# EAGLE design LAN-Bee_v12 (EAGLE 7.7.0)
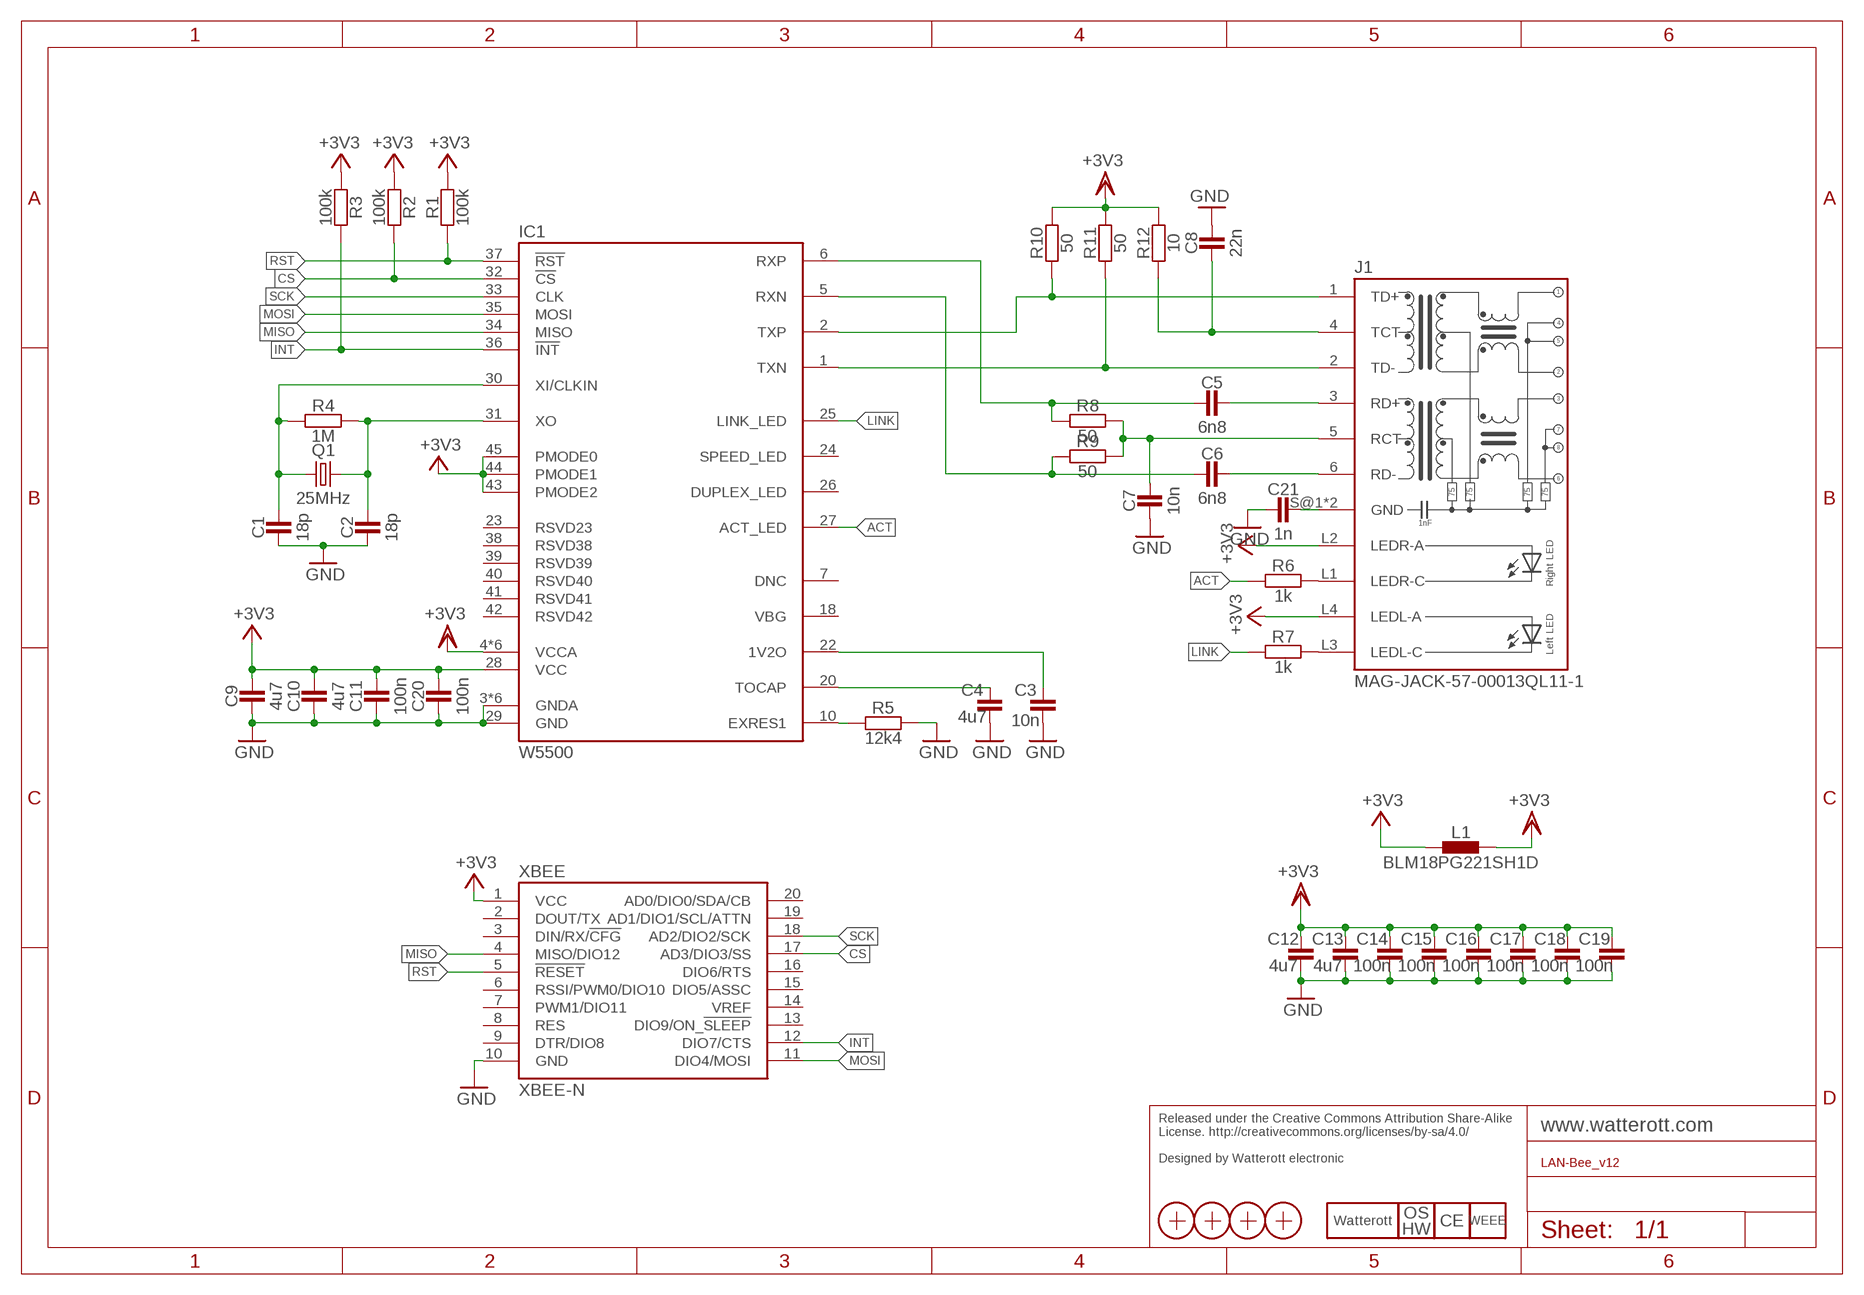
[diagram p0: schematic, sheet 1]

## Parts
C1  18p  CAPACITOR-0402  [C0402]
C2  18p  CAPACITOR-0402  [C0402]
C3  10n  CAPACITOR-0402  [C0402]
C4  4u7  CAPACITOR-0603  [C0603]
C5  6n8  CAPACITOR-0402  [C0402]
C6  6n8  CAPACITOR-0402  [C0402]
C7  10n  CAPACITOR-0402  [C0402]
C8  22n  CAPACITOR-0402  [C0402]
C9  4u7  CAPACITOR-0603  [C0603]
C10  4u7  CAPACITOR-0603  [C0603]
C11  100n  CAPACITOR-0402  [C0402]
C12  4u7  CAPACITOR-0603  [C0603]
C13  4u7  CAPACITOR-0603  [C0603]
C14  100n  CAPACITOR-0402  [C0402]
C15  100n  CAPACITOR-0402  [C0402]
C16  100n  CAPACITOR-0402  [C0402]
C17  100n  CAPACITOR-0402  [C0402]
C18  100n  CAPACITOR-0402  [C0402]
C19  100n  CAPACITOR-0402  [C0402]
C20  100n  CAPACITOR-0402  [C0402]
C21  1n  CAPACITOR-0805  [C0805]
IC1  W5500  [TQFP48]
J1  MAG-JACK-57-00013QL11-1  [RJ45_57-00013QL11-1]
L1  BLM18PG221SH1D  INDUCTOR-0603  [C0603]
LOGO1  LOGO_WEEE-4  [WEEE_4MM]
LOGO2  LOGO_CE-2  [CE_2MM]
LOGO3  LOGO_OSHW-2  [OSHW_2MM]
LOGO5  LOGO_SPARK-2  [SPARK_2MM]
Q1  25MHz  CRYSTAL-CC2  [CRYSTAL_CC2]
R1  100k  RESISTOR-0402  [C0402]
R2  100k  RESISTOR-0402  [C0402]
R3  100k  RESISTOR-0402  [C0402]
R4  1M  RESISTOR-0402  [C0402]
R5  12k4  RESISTOR-0402  [C0402]
R6  1k  RESISTOR-0402  [C0402]
R7  1k  RESISTOR-0402  [C0402]
R8  50  RESISTOR-0402  [C0402]
R9  50  RESISTOR-0402  [C0402]
R10  50  RESISTOR-0402  [C0402]
R11  50  RESISTOR-0402  [C0402]
R12  10  RESISTOR-0402  [C0402]
X1  PASSER-07  [PASSER_07MM]
X2  PASSER-07  [PASSER_07MM]
X3  PASSER-07  [PASSER_07MM]
X4  PASSER-07  [PASSER_07MM]
XBEE  XBEE-N  [XBEE_N]

## Nets
+3V3: C9.2 C10.2 C11.2 C20.2 IC1.28(VCC) IC1.43(PMODE2) IC1.44(PMODE1) IC1.45(PMODE0) J1.L2(LEDR-A) J1.L4(LEDL-A) L1.1 R1.2 R2.2 R3.2 XBEE.1(VCC)
ACT: IC1.27(ACT_LED) R6.2
CS: IC1.32(!CS) R2.1 XBEE.17(AD3/DIO3/SS)
GND: C1.1 C2.1 C3.1 C4.1 C7.1 C8.2 C9.1 C10.1 C11.1 C12.1 C13.1 C14.1 C15.1 C16.1 C17.1 C18.1 C19.1 C20.1 C21.1 IC1.3(GNDA) IC1.9(GNDA) IC1.14(GNDA) IC1.16(GNDA) IC1.19(GNDA) IC1.29(GND) IC1.48(GNDA) R5.2 XBEE.10(GND)
INT: IC1.36(!INT) R3.1 XBEE.12(DIO7/CTS)
LEDLC: J1.L3(LEDL-C) R7.1
LEDRC: J1.L1(LEDR-C) R6.1
LINK: IC1.25(LINK_LED) R7.2
MISO: IC1.34(MISO) XBEE.4(MISO/DIO12)
MOSI: IC1.35(MOSI) XBEE.11(DIO4/MOSI)
N$5: IC1.10(EXRES1) R5.1
N$6: C3.2 IC1.22(1V2O)
N$7: C4.2 IC1.20(TOCAP)
N$8: C2.2 IC1.31(XO) Q1.2 R4.2
N$9: C1.2 IC1.30(XI/CLKIN) Q1.1 R4.1
RCT: C7.2 J1.5(RCT) R8.1 R9.1
RD+: C5.2 J1.3(RD+)
RD-: C6.2 J1.6(RD-)
RST: IC1.37(!RST) R1.1 XBEE.5(!RESET!)
RXN: C6.1 IC1.5(RXN) R9.2
RXP: C5.1 IC1.6(RXP) R8.2
SCK: IC1.33(CLK) XBEE.18(AD2/DIO2/SCK)
SHLD: C21.2 J1.S@1(GND) J1.S@2(GND)
TCT: C8.1 J1.4(TCT) R12.2
TD+: IC1.2(TXP) J1.1(TD+) R10.2
TD-: IC1.1(TXN) J1.2(TD-) R11.2
VDD: C12.2 C13.2 C14.2 C15.2 C16.2 C17.2 C18.2 C19.2 IC1.4(VCCA) IC1.8(VCCA) IC1.11(VCCA) IC1.15(VCCA) IC1.17(VCCA) IC1.21(VCCA) L1.2 R10.1 R11.1 R12.1 ; supply symbol labelled +3V3
Unconnected: IC1.7(DNC) IC1.18(VBG) IC1.23(RSVD23) IC1.24(SPEED_LED) IC1.26(DUPLEX_LED) IC1.38(RSVD38) IC1.39(RSVD39) IC1.40(RSVD40) IC1.41(RSVD41) IC1.42(RSVD42) XBEE.2(DOUT/TX) XBEE.3(DIN/RX/!CFG!) XBEE.6(RSSI/PWM0/DIO10) XBEE.7(PWM1/DIO11) XBEE.8(RES) XBEE.9(DTR/DIO8) XBEE.13(DIO9/ON_!SLEEP!) XBEE.14(VREF) XBEE.15(DIO5/ASSC) XBEE.16(DIO6/RTS) XBEE.19(AD1/DIO1/SCL/ATTN) XBEE.20(AD0/DIO0/SDA/CB)

## Notes on the sheet
- Released under the Creative Commons Attribution Share-Alike 
  License. http://creativecommons.org/licenses/by-sa/4.0/
  
  Designed by Watterott electronic

## Library data of the parts
C1-C21 = we-rcl:CAPACITOR: Capacitors ...2.2uF @ 6.3V -> 0402 ...4.7uF @ 6.3V -> 0603 ...10uF @ 16V -> 0805 ...22uF @ 25V -> 1206
IC1 = we-chip:W5500: WIZnet W5500 Ethernet Controller (5V tolerante IOs)
J1 = we-con:MAG-JACK: RJ45 connector with integrated magnetics (MagJack) Wuerth 7499011222A (THT) UDE 57-00013QL11-1 (THT, Low Profile) Taimag RJSL-002TC1 (SMD, Low Profile)
L1 = we-rcl:INDUCTOR: Inductors Ferrite Bead - Murata BLM18PG 0603 3.0A 33Ohm @ 100MH -> BLM18PG330SN1D 0603 2.0A 120Ohm @ 100MH -> BLM18PG121SN1D 0603 1.4A 220Ohm @ 100MH -> BLM18PG221SH1D 0603 1.2A 330Ohm @ 100MH -> BLM18PG331SN1D 0603 1.0A 470Ohm @ 100MH -> BLM18PG471SN1D
LOGO1 = we-symbol:LOGO_WEEE: WEEE Logo
LOGO2 = we-symbol:LOGO_CE: CE Logo
LOGO3 = we-symbol:LOGO_OSHW: Open-Source-Hardware Logo
LOGO5 = we-symbol:LOGO_SPARK: Watterott electronic Logo
Q1 = we-rcl:CRYSTAL: Crystals
R1-R12 = we-rcl:RESISTOR: Resistors all kinds in 0402 and 0603
X1-X4 = we-symbol:PASSER: Fiducial Markers
XBEE = we-board:XBEE: XBEE connector

## Board
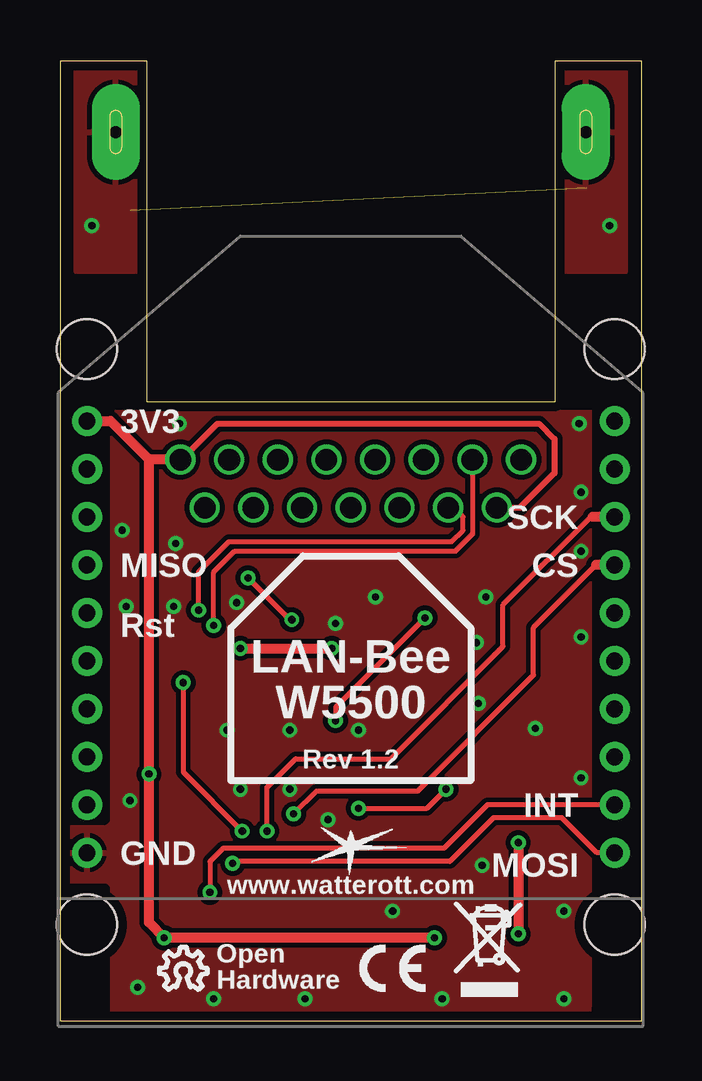
[diagram p1: board, top side]
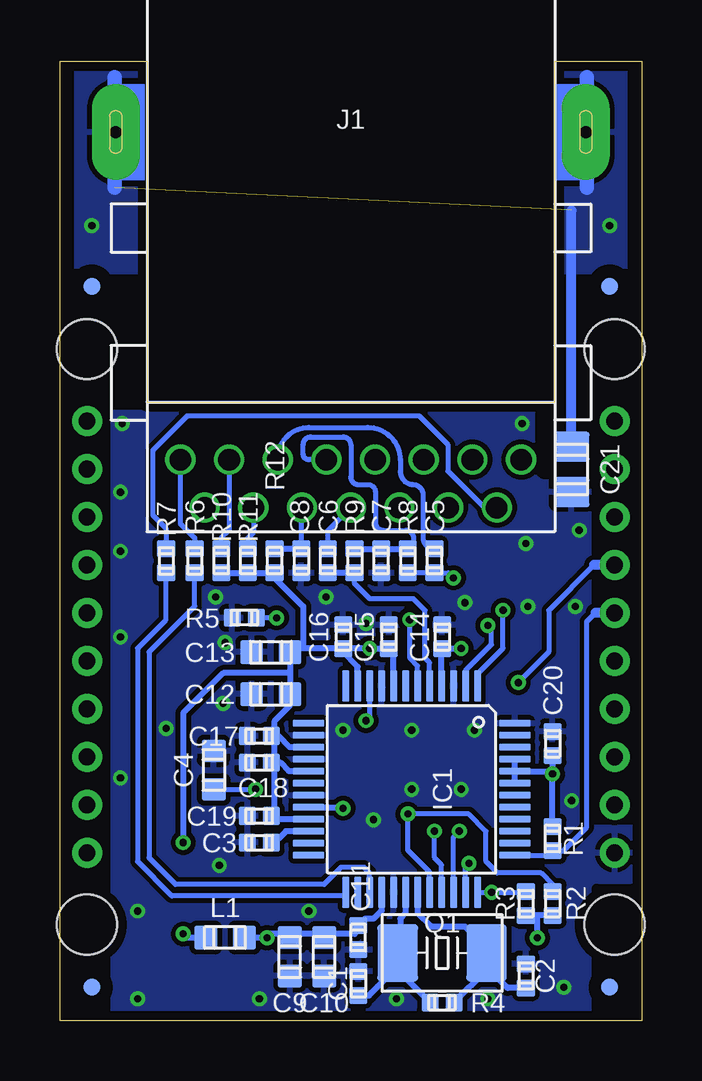
[diagram p2: board, bottom side, seen from below]

Size 24.25 x 40 mm. Coordinates in mm from the lower left corner, seen from the top.
Outline: 24.25,0 24.25,40 20.62,40 20.62,25.8 3.62,25.8 3.62,40 0,40 0,0 24.25,0
Copper layers (1*16): Top 0.035mm / dielectric 1.5mm / Bottom 0.035mm
Design rules "we-dru-2-layer *": minimum track width 0.15mm, minimum drill 0.3mm, track to track 0.15mm, track to pad 0.15mm, pad to pad 0.15mm, via to via 0.15mm, smd to smd 0.1mm, copper to edge 0.4mm, drill to drill 0.2mm, minimum pad ring 0.18mm, minimum via ring 0.16mm, stop-mask expansion 0.1mm, vias tented up to drill 0.5mm, thermal gap 0.2mm
Holes 2.5 mm at 1.12,4 23.12,4 1.12,28 23.12,28
tRestrict: area 0.4,8.4 to 1.9,29; area 22.4,0.5 to 23.9,29; area 0.4,0.5 to 1.9,5.5
bRestrict: area 0.4,8.4 to 1.9,29; area 22.4,0.5 to 23.9,29; area 0.4,0.5 to 1.9,5.5; 2 lines

### Footprints (pad centres in the part's own frame; a part is rotated, then mirrored left to right if it is on the bottom)
C0402 = smd 0.75 x 0.7: 1 0,0.5; 2 0,-0.5
C0603 = smd 1 x 0.95: 1 0,0.8; 2 0,-0.8
C0805 = smd 1.5 x 1.25: 1 0,0.95; 2 0,-0.95
TQFP48 = smd 1.3 x 0.28: 1 -4.3,2.75; 2 -4.3,2.25; 3 -4.3,1.75; 4 -4.3,1.25; 5 -4.3,0.75; 6 -4.3,0.25; 7 -4.3,-0.25; 8 -4.3,-0.75; 9 -4.3,-1.25; 10 -4.3,-1.75; 11 -4.3,-2.25; 12 -4.3,-2.75; 25 4.3,-2.75; 26 4.3,-2.25; 27 4.3,-1.75; 28 4.3,-1.25; 29 4.3,-0.75; 30 4.3,-0.25; 31 4.3,0.25; 32 4.3,0.75; 33 4.3,1.25; 34 4.3,1.75; 35 4.3,2.25; 36 4.3,2.75 | smd 0.28 x 1.3: 13 -2.75,-4.3; 14 -2.25,-4.3; 15 -1.75,-4.3; 16 -1.25,-4.3; 17 -0.75,-4.3; 18 -0.25,-4.3; 19 0.25,-4.3; 20 0.75,-4.3; 21 1.25,-4.3; 22 1.75,-4.3; 23 2.25,-4.3; 24 2.75,-4.3; 37 2.75,4.3; 38 2.25,4.3; 39 1.75,4.3; 40 1.25,4.3; 41 0.75,4.3; 42 0.25,4.3; 43 -0.25,4.3; 44 -0.75,4.3; 45 -1.25,4.3; 46 -1.75,4.3; 47 -2.25,4.3; 48 -2.75,4.3
RJ45_57-00013QL11-1 = drill 0.9: 1 -5.075,-11.66; 2 -4.06,-13.66; 3 -3.045,-11.66; 4 -2.03,-13.66; 5 -1.015,-11.66; 6 0,-13.66; 7 1.015,-11.66; 8 2.03,-13.66; 9 3.045,-11.66; 10 4.06,-13.66; 11 5.075,-11.66; L1 -7.105,-11.66; L2 -6.09,-13.66; L3 6.09,-13.66; L4 7.105,-11.66 | drill 0.5 pad 2 long: S@1 -9.8,2; S@2 9.8,2
CRYSTAL_CC2 = smd 2.4 x 1.7: 1 0,1.85; 2 0,-1.85
PASSER_07MM = smd 0.7 x 0.7: X 0,0
XBEE_N = drill 0.7 pad 1.25: 1 -11,9; 2 -11,7; 3 -11,5; 4 -11,3; 5 -11,1; 6 -11,-1; 7 -11,-3; 8 -11,-5; 9 -11,-7; 10 -11,-9; 11 11,-9; 12 11,-7; 13 11,-5; 14 11,-3; 15 11,-1; 16 11,1; 17 11,3; 18 11,5; 19 11,7; 20 11,9

### Placement (x,y rotation side)
C1  11.81,1.55 0 bottom
C2  4.82,1.87 0 bottom
C3  15.94,7.43 90 bottom
C4  17.84,10.44 0 bottom
C5  8.63,19.18 180 bottom
C6  13.08,19.18 180 bottom
C7  10.86,19.18 180 bottom
C8  14.19,19.18 0 bottom
C9  14.66,2.66 180 bottom
C10  13.24,2.66 180 bottom
C11  11.81,3.46 180 bottom
C12  15.46,13.62 90 bottom
C13  15.46,15.37 90 bottom
C14  8.31,16 0 bottom
C15  10.54,16 0 bottom
C16  12.44,16 0 bottom
C17  15.94,11.87 90 bottom
C18  15.94,10.76 90 bottom
C19  15.94,8.54 90 bottom
C20  3.71,11.55 0 bottom
C21  2.92,22.98 180 bottom
IC1  9.59,9.65 270 bottom
J1  12.12,35.05 0 bottom
L1  17.36,3.46 270 bottom
LOGO1  17.84,2.98 0 top
LOGO2  13.87,2.19 0 top
LOGO3  5.14,2.19 0 top
LOGO5  12.12,7.27 0 top
Q1  8.31,2.82 90 bottom
R1  3.71,7.59 180 bottom
R2  3.71,4.89 0 bottom
R3  4.82,4.89 0 bottom
R4  8.31,0.76 90 bottom
R5  16.57,16.79 270 bottom
R6  18.63,19.18 0 bottom
R7  19.82,19.18 0 bottom
R8  9.74,19.18 0 bottom
R9  11.97,19.18 0 bottom
R10  17.52,19.18 180 bottom
R11  16.41,19.18 180 bottom
R12  15.3,19.18 180 bottom
X1  1.33,1.39 0 bottom
X2  1.33,30.61 0 bottom
X3  22.92,30.61 0 bottom
X4  22.92,1.39 0 bottom
XBEE  12.12,16 0 top

### Tracks (layer width: path | path; a pad name or v marks a point on that pad's centre or on a via)
+3V3  (via drill 0.3)
  Top 0.203: 3.72,23.39 3.71,23.38
  Top 0.254: J1.L2 19.18,21.39 20.62,22.83 20.62,24.26 19.98,24.89 6.57,24.89 5.07,23.39 J1.L4
  Top 0.406: v15.62,3.46 v4.35,3.46 3.71,4.09 v3.71,10.29 3.71,23.38 | J1.L4 3.72,23.39 2.11,25 XBEE.1
  Bottom 0.203: C9.2 14.66,3.62 | C10.2 13.24,3.62
  Bottom 0.254: IC1.43 IC1.44 | IC1.44 IC1.45 | R1.2 v3.71,10.29 | L1.1 v15.62,3.46 15.46,3.62 14.66,3.62 13.24,3.62 11.97,3.62 11.81,3.78 C11.2 | R2.2 4.35,4.39 | 4.35,4.39 R3.2 | C20.2 v3.71,10.29 | IC1.44 3.83,10.4 v3.71,10.29 | v4.35,3.46 4.35,4.39 | IC1.28 10.84,4.59 11.17,4.25 11.51,4.25 C11.2 | 11.81,3.94 C11.2
ACT
  Bottom 0.203: IC1.27 11.34,6.16 11.57,6.4 12.52,6.4 13.24,5.68 19.43,5.68 20.54,6.79 20.54,15.37 18.63,17.27 R6.2
CS  (via drill 0.3)
  Top 0.203: v9.74,8.62 10.7,9.57 14.9,9.57 19.75,14.41 19.75,16.4 22.35,19
  Top 0.406: XBEE.17 22.35,19
  Bottom 0.203: R2.1 3.71,5.68 4.19,6.16 6.01,6.16 6.49,6.63 6.49,7.9 7.2,8.62 v9.74,8.62 9.74,7.11 8.84,6.2 IC1.32
GND  (via drill 0.3)
  other vias: 7.36,17.43 11.49,16.56 21.65,24.89 9.59,12.11 6.97,12.11 12.44,12.11 3.23,1.39 17.36,15.76 21.73,19.57 21.73,16 9.59,9.65 17.44,13.22 21.73,10.13 19.82,12.19 15.94,0.92 11.17,8.38 2.6,20.45 4.74,17.27 21.73,22.03 2.76,17.27 21.02,4.57 6.41,0.92 21.02,0.92 17.6,6.47 7.52,9.65 4.82,19.89 13.16,17.67 4.98,24.89 10.22,0.92 13.87,4.57 2.92,9.17 17.76,17.67
  pour Top (isolate 0.203): 24.25,0 0,0 0,25.39 24.25,25.39
  pour Bottom (isolate 0.203): 0,0 24.25,0 24.25,25.39 0,25.39
INT  (via drill 0.3)
  Top 0.203: XBEE.12 17.82,9 16.01,7.19 6.81,7.19 6.25,6.63 v6.25,5.35
  Bottom 0.203: IC1.36 v6.25,5.35 4.86,5.35 R3.1
LEDLC
  Bottom 0.203: R7.1 19.82,20.52 20.38,21.08 20.38,23.78 18.95,25.21 9.27,25.21 8.08,24.02 8.08,22.91 6.56,21.39 J1.L3
LEDRC
  Bottom 0.203: J1.L1 19.23,20.72 18.63,20.13 R6.1
LINK
  Bottom 0.203: IC1.25 12.34,5.23 12.36,5.21 19.59,5.21 21.02,6.63 21.02,15.52 19.82,16.71 R7.2
MISO  (via drill 0.3)
  Top 0.203: v5.14,14.1 5.14,10.36 v7.6,7.9
  Bottom 0.203: 1.98,19 3.87,17.11 3.87,15.37 v5.14,14.1 | IC1.34 7.83,7.67 v7.6,7.9
  Bottom 0.406: XBEE.4 1.98,19
MOSI  (via drill 0.3)
  Top 0.203: XBEE.11 22.39,7 20.94,8.46 18.08,8.46 16.25,6.63 7.28,6.63 v7.2,6.55
  Bottom 0.203: IC1.35 7.33,6.42 v7.2,6.55
N$5  (via drill 0.3)
  Top 0.203: v15.22,16.79 11.49,13.06 v11.49,12.51
  Bottom 0.203: v15.22,16.79 R5.1 | IC1.10 11.34,12.66 v11.49,12.51
N$6
  Bottom 0.203: 15.14,7.59 15.28,7.59 C3.2
  Bottom 0.254: IC1.22 14.83,7.9 15.14,7.59
N$7  (via drill 0.3)
  Top 0.203: v12.44,8.86 15.3,8.86 v16.09,9.65
  Bottom 0.203: C4.2 v16.1,9.64 v16.09,9.65
  Bottom 0.254: IC1.20 12.49,8.9 v12.44,8.86
N$8
  Bottom 0.254: 6.46,2.11 Q1.2 6.57,2.93 6.57,3.14 7.36,3.94 8.79,3.94 9.34,4.48 IC1.31 | 6.46,2.11 R4.2 | C2.2 5.59,1.37 6.09,1.87 6.23,1.87 6.46,2.11
N$9
  Bottom 0.254: Q1.1 10.16,2.11 R4.1 | C1.2 11.36,1.05 10.38,2.03 10.38,2.61 Q1.1 | IC1.30 9.84,4.48 10.06,4.25 10.06,2.93 Q1.1
RCT
  Bottom 0.203: R8.1 arc-90 9.51,19.91 9.51,20.13 arc-90 9.82,20.45 10.78,20.45 arc90 11.09,20.76 11.09,22.03 arc-90 11.41,22.35 11.81,22.35 arc90 12.12,22.67 12.12,24.02 arc-90 12.44,24.33 13.79,24.33 arc-90 14.11,24.02 14.11,23.62 arc-90 13.88,23.39 J1.5
  Bottom 0.254: R9.1 C7.2 R8.1
RD+
  Bottom 0.203: C5.2 8.66,19.68 arc90 9.11,20.13 9.11,21.87 arc-90 9.51,22.35 arc90 10.06,22.91 10.06,23.38 arc-90 11.41,24.73 13.87,24.73 arc-90 15.17,23.43 J1.3
RD-
  Bottom 0.203: C6.2 13.08,20.44 J1.6
RST
  Bottom 0.203: IC1.37 3.9,6.9 R1.1 3.26,7.09 2.28,8.06 2.28,16.64 1.92,17
  Bottom 0.406: XBEE.5 1.92,17
RXN
  Bottom 0.203: IC1.5 8.84,14.93 9.03,15.13 9.03,17.11 9.51,17.59 11.33,17.59 11.97,18.22 R9.2
  Bottom 0.254: R9.2 C6.1
RXP  (via drill 0.3)
  Top 0.203: v9.66,16.71 9.59,16.71 v7.84,18.46
  Bottom 0.203: IC1.6 9.34,14.8 9.66,15.13 v9.66,16.71 | R8.2 C5.1 8.05,18.68 v7.84,18.46
SCK  (via drill 0.3)
  Top 0.203: v8.63,7.9 8.63,9.73 9.82,10.92 13.79,10.92 18.48,15.6 18.48,17.35 22.13,21 22.2,21
  Top 0.406: XBEE.18 22.2,21
  Bottom 0.203: IC1.33 8.34,6.49 8.63,6.79 v8.63,7.9
SHLD  (via drill 0.3)  (1 unrouted)
  Bottom 0.406: C21.2 2.92,33.78 | J1.S@2 2.32,37.07 2.28,37.11 | J1.S@1 21.93,37.07 21.97,37.11
  Bottom 0.61: 2.28,34.73 2.28,37.11 2.28,39.34 | 21.97,34.73 21.97,37.11 21.97,39.34
  other vias: 1.33,33.14 22.92,33.14
  pour Bottom (isolate 0.254, rank 2): 0.7,39.65 23.55,39.65 23.55,31.24 0.7,31.24
  pour Top (isolate 0.254, rank 2): 0.7,39.65 23.55,39.65 23.55,31.24 0.7,31.24
TCT
  Bottom 0.203: J1.4 14.15,21.35 14.19,21.32 C8.1
  Bottom 0.254: C8.1 R12.2
TD+  (via drill 0.3)
  Top 0.203: v6.41,16.48 6.41,18.7 7.28,19.57 16.49,19.57 17.2,20.28 J1.1
  Bottom 0.203: IC1.2 7.33,14.6 6.25,15.68 6.25,16.32 v6.41,16.48 | R10.2 17.52,20.14 17.2,20.46 J1.1
TD-  (via drill 0.3)
  Top 0.203: v5.78,17.11 5.78,18.7 7.04,19.97 16.33,19.97 16.81,20.45 16.81,21 16.42,21.39 J1.2
  Bottom 0.203: IC1.1 6.83,14.46 5.78,15.52 v5.78,17.11 | J1.2 16.18,20.35 16.41,20.13 R11.2
VDD  (via drill 0.3)
  Top 0.406: v7.52,15.52 v11.33,15.52 | v19.11,7.43 v19.11,3.62
  Bottom 0.203: C14.2 8.34,15.5 8.34,15.52 | 10.34,15.3 C15.2 10.56,15.52 | 12.42,15.52 C16.2 12.44,15.52 | 15.46,8.54 C19.2 15.3,8.54 | 15.3,10.63 C18.2 15.3,10.76 | C12.2
  Bottom 0.254: IC1.21 15.3,8.4 C19.2 | IC1.11 11.84,14.76 12.44,15.37 C16.2 | 14.66,14.49 C13.2 14.5,15.52 14.19,15.52 | 14.66,14.49 C12.2 | IC1.4 8.34,15.5 | 8.34,15.52 v7.52,15.52 | IC1.8 10.34,15.3 | 12.42,15.52 v11.33,15.52 10.56,15.52 | IC1.17 14.7,10.4 15.06,10.76 C18.2 | 15.3,8.54 15.3,10.63 | 15.3,10.76 15.3,11.87 | 15.3,11.87 15.3,12.51 14.66,13.14 C12.2 | 14.66,14.49 17.44,14.49 19.11,12.82 v19.11,7.43 | 12.44,15.52 14.19,15.52 | 14.19,15.52 14.11,15.6 14.11,17.27 15.3,18.46 R12.1 R11.1 R10.1 | L1.2 18.95,3.46 v19.11,3.62 | IC1.15 14.67,11.4 15.14,11.87 15.3,11.87 | C17.2 15.3,11.87

### Text on the board
tPlace: 3V3 | SCK | MISO | CS | Rst | LAN-Bee | W5500 | Rev 1.2 | INT | GND | www.watterott.com | MOSI | Open | Hardware
Reference: Silkscreen: 21 tPlace